# EAGLE design nanomodem (EAGLE 8.5.0)
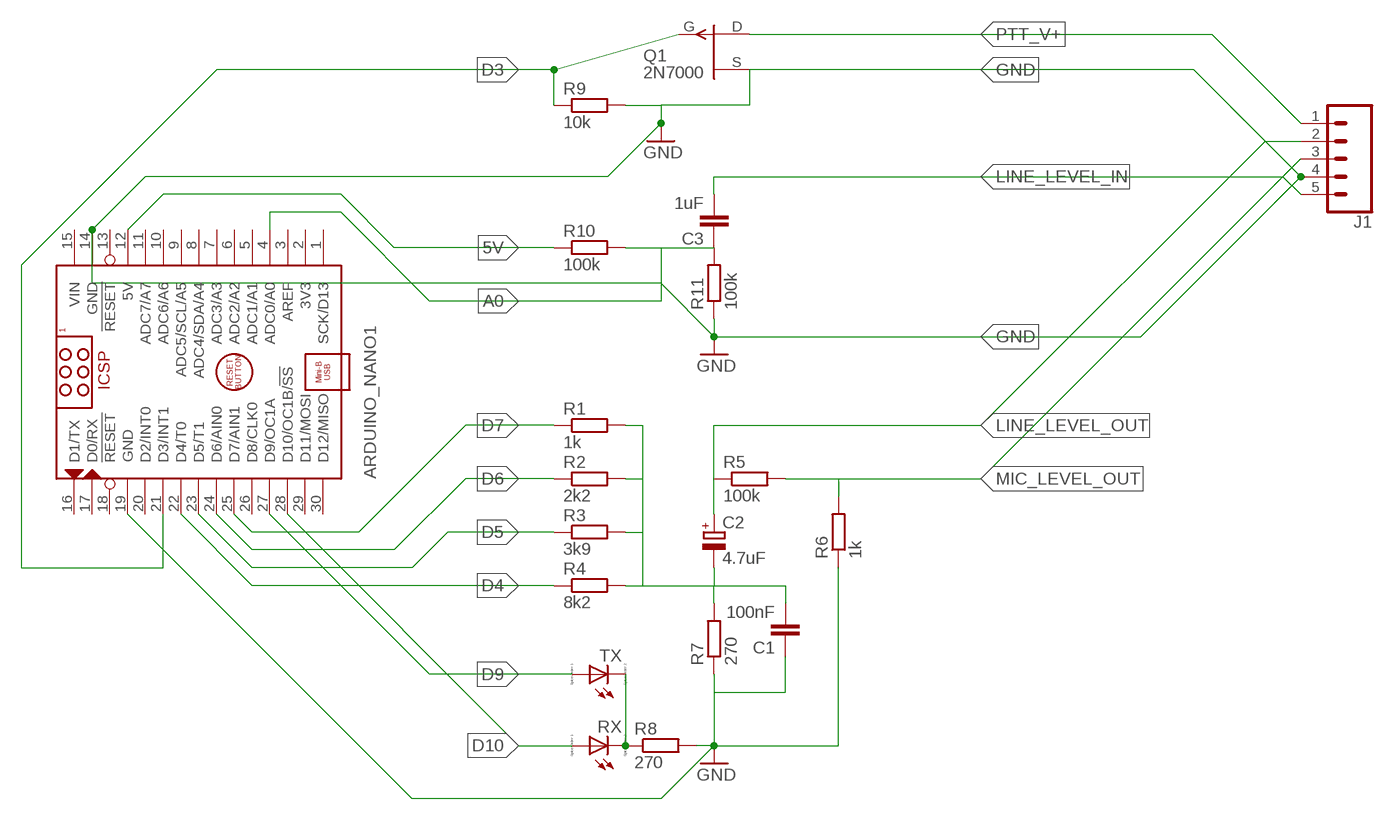
[diagram p0: schematic, sheet 1]

## Parts
ARDUINO_NANO1  ARDUINO_NANO  [ARDUINO_NANO]
C1  100nF  C2.5/2  [C2.5-2]
C2  4.7uF  CPOL-EUE2.5-5V  [E2,5-4R]
C3  1uF  C2.5/2  [C2.5-2]
J1  CONN_05  [1X05]
Q1  2N7000  2N3820  [TO92_MOD]
R1  1k  R-EU_0204/2V  [0204V]
R2  2k2  R-EU_0204/2V  [0204V]
R3  3k9  R-EU_0204/2V  [0204V]
R4  8k2  R-EU_0204/2V  [0204V]
R5  100k  R-EU_0204/2V  [0204V]
R6  1k  R-EU_0204/2V  [0204V]
R7  270  R-EU_0204/2V  [0204V]
R8  270  R-EU_0204/2V  [0204V]
R9  10k  R-EU_0204/2V  [0204V]
R10  100k  R-EU_0204/2V  [0204V]
R11  100k  R-EU_0204/2V  [0204V]
RX  LED_ELD260  [LED_LD260]
TX  LED_ELD260  [LED_LD260]

## Nets
5V: ARDUINO_NANO1.12(5V) R10.1
A0: ARDUINO_NANO1.4(ADC0/A0) C3.1 R10.2 R11.2
D3: ARDUINO_NANO1.21(D3/INT1) Q1.2(G) R9.1
D4: ARDUINO_NANO1.22(D4/T0) R4.1
D5: ARDUINO_NANO1.23(D5/T1) R3.1
D6: ARDUINO_NANO1.24(D6/AIN0) R2.1
D7: ARDUINO_NANO1.25(D7/AIN1) R1.1
D9: ARDUINO_NANO1.27(D9/OC1A) TX.A
D10: ARDUINO_NANO1.28(D10/OC1B/!SS) RX.A
GND: ARDUINO_NANO1.14(GND) ARDUINO_NANO1.19(GND) C1.1 J1.4 Q1.3(D) R6.1 R7.1 R8.2 R9.2 R11.1
LINE_LEVEL_IN: C3.2 J1.5
LINE_LEVEL_OUT: C2.+ J1.2 R5.1
MIC_LEVEL_OUT: J1.3 R5.2 R6.2
N$1: R8.1 RX.K(C) TX.K(C)
N$5: C1.2 C2.- R1.2 R2.2 R3.2 R4.2 R7.2
PTT_V+: J1.1 Q1.1(S)
Unconnected: ARDUINO_NANO1.1(SCK/D13) ARDUINO_NANO1.2(3V3) ARDUINO_NANO1.3(AREF) ARDUINO_NANO1.5(ADC1/A1) ARDUINO_NANO1.6(ADC2/A2) ARDUINO_NANO1.7(ADC3/A3) ARDUINO_NANO1.8(ADC4/SDA/A4) ARDUINO_NANO1.9(ADC5/SCL/A5) ARDUINO_NANO1.10(ADC6/A6) ARDUINO_NANO1.11(ADC7/A7) ARDUINO_NANO1.13(!RESET) ARDUINO_NANO1.16(D1/TX) ARDUINO_NANO1.17(D0/RX) ARDUINO_NANO1.18(!RESET) ARDUINO_NANO1.20(D2/INT0) ARDUINO_NANO1.26(D8/CLK0) ARDUINO_NANO1.29(D11/MOSI) ARDUINO_NANO1.30(D12/MISO)

## Power pins joined to a net without a drawn wire
VIN: ARDUINO_NANO1.15(VIN)

## Library data of the parts
ARDUINO_NANO1 = ArduinoNanoV30:ARDUINO_NANO: Arduino Nano V3.0 Module Overview: The Arduino Nano is a small, complete, and breadboard-friendly board based on the ATmega328 (Arduino Nano 3.x) or ATmega168 (Arduino Nano 2.x). It has more or less the same functionality of the Arduino Duemilanove, but in a different package. It lacks only a DC power jack, and works with a Mini-B USB cable instead of a standard one. The Nano was designed and is being produced by Gravitech <http://www.gravitech.us/arna30wiatp.html>. General specifications: Item Value Microcontroller Atmel ATmega168 or ATmega328 Operating Voltage (logic level) 5 V Input Voltage (recommended) 7-12 V Input Voltage (limits) 6-20 V Digital I/O Pins 14 (of which 6 provide PWM output) Analog Input Pins 8 DC Current per I/O Pin 40 mA Flash Memory 16 KB (ATmega168) or 32 KB (ATmega328) of which 2 KB used by bootloader SRAM 1 KB (ATmega168) or 2 KB (ATmega328) EEPROM 512 bytes (ATmega168) or 1 KB (ATmega328) Clock Speed 16 MHz Dimensions (Inches) 0.73" x 1.70" Dimensions (mm) 18mm x 45mm Overall height About 9 mm (not including pins) Weigth 5 g Power: The Arduino Nano can be powered via the Mini-B USB connection, 6-20V unregulated external power supply (pin 30), or 5V regulated external power supply (pin 27). The power source is automatically selected to the highest voltage source. Memory: The ATmega168 has 16 KB of flash memory for storing code (of which 2 KB is used for the bootloader); the ATmega328 has 32 KB, (also with 2 KB used for the bootloader). The ATmega168 has 1 KB of SRAM and 512 bytes of EEPROM (which can be read and written with the EEPROM library); the ATmega328 has 2 KB of SRAM and 1 KB of EEPROM. Input and Output: Each of the 14 digital pins on the Nano can be used as an input or output, using pinMode(), digitalWrite(), and digitalRead() functions. They operate at 5 volts. Each pin can provide or receive a maximum of 40 mA and has an internal pull-up resistor (disconnected by default) of 20-50 kOhms. In addition, some pins have specialized functions. Visit Arduino - ArduinoBoardNano <https://www.arduino.cc/en/Main/ArduinoBoardNano>
C1 C3 = capacitor-wima:C: CAPACITOR naming: grid - package width
C2 = resistor:CPOL-EU: POLARIZED CAPACITOR, European symbol
J1 = SparkFun-Connectors:CONN_05: Multi connection point. Often used as Generic Header-pin footprint for 0.1 inch spaced/style header connections On any of the 0.1 inch spaced packages, you can populate with these: Break Away Headers - Straight <https://www.sparkfun.com/products/116> (PRT-00116) Break Away Male Headers - Right Angle <https://www.sparkfun.com/products/553> (PRT-00553) Female Headers <https://www.sparkfun.com/products/115> (PRT-00115) Break Away Headers - Machine Pin <https://www.sparkfun.com/products/117> (PRT-00117) Break Away Female Headers - Swiss Machine Pin <https://www.sparkfun.com/products/743> (PRT-00743) For SCREWTERMINALS and SPRING TERMINALS visit here: Screw Terimnals on SparkFun.com <https://www.sparkfun.com/search/results?term=Screw+Terminals> (5mm/3.5mm/2.54mm spacing) This device is also useful as a general connection point to wire up your design to another part of your project. Our various solder wires solder well into these plated through hole pads. Hook-Up Wire - Assortment (Stranded, 22 AWG) <https://www.sparkfun.com/products/11375> (PRT-11375) Hook-Up Wire - Assortment (Solid Core, 22 AWG) <https://www.sparkfun.com/products/11367> (PRT-11367) View the entire wire category on our website here <https://www.sparkfun.com/categories/141> Special notes: Molex polarized connector foot print use with SKU : PRT-08231 with associated crimp pins and housings. 1MM SMD Version SKU: PRT-10208
Q1 = transistor-fet-edited:2N3820: P-Channel Junction FET Source: http://www.fairchildsemi.com/ds/2N/2N3820.pdf
R1-R8 = resistor:R-EU_: RESISTOR, European symbol
R9-R11 = rcl:R-EU_: RESISTOR, European symbol
RX TX = eagle-ltspice:LED_E: LED Source: http://www.osram.convergy.de Source: www.luxeon.com Source: www.kingbright.com; SPICEMODEL: NONE; SPICEPREFIX: D; SPICETYPE: diode

## Board
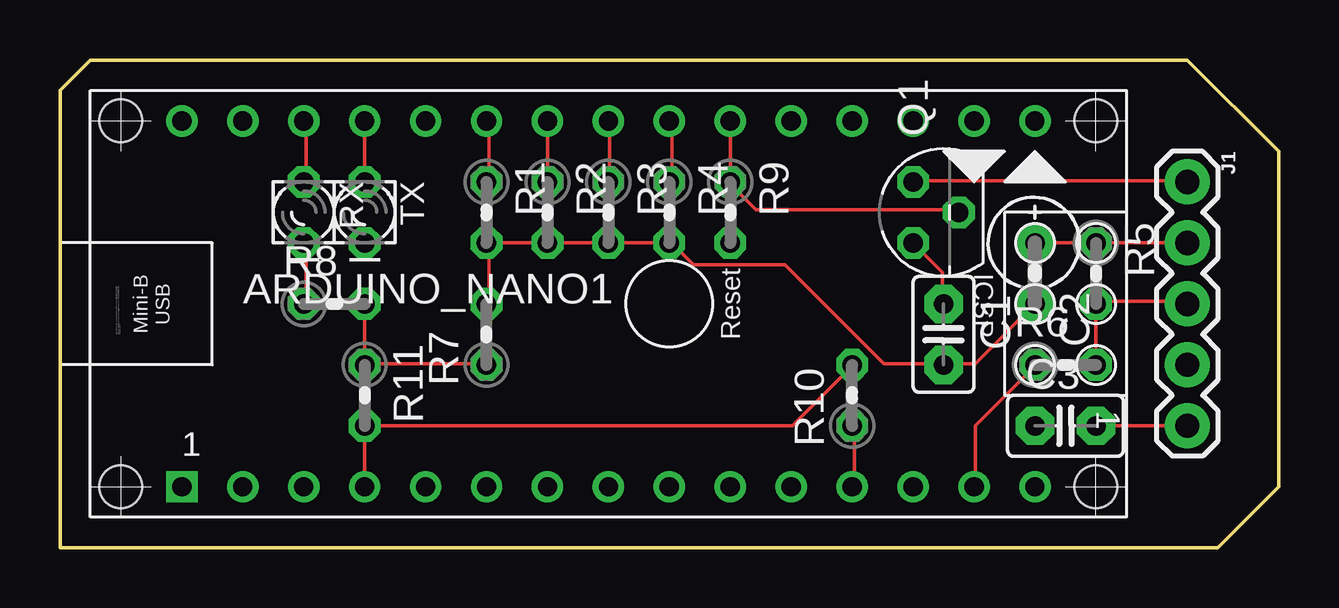
[diagram p1: board, top side]
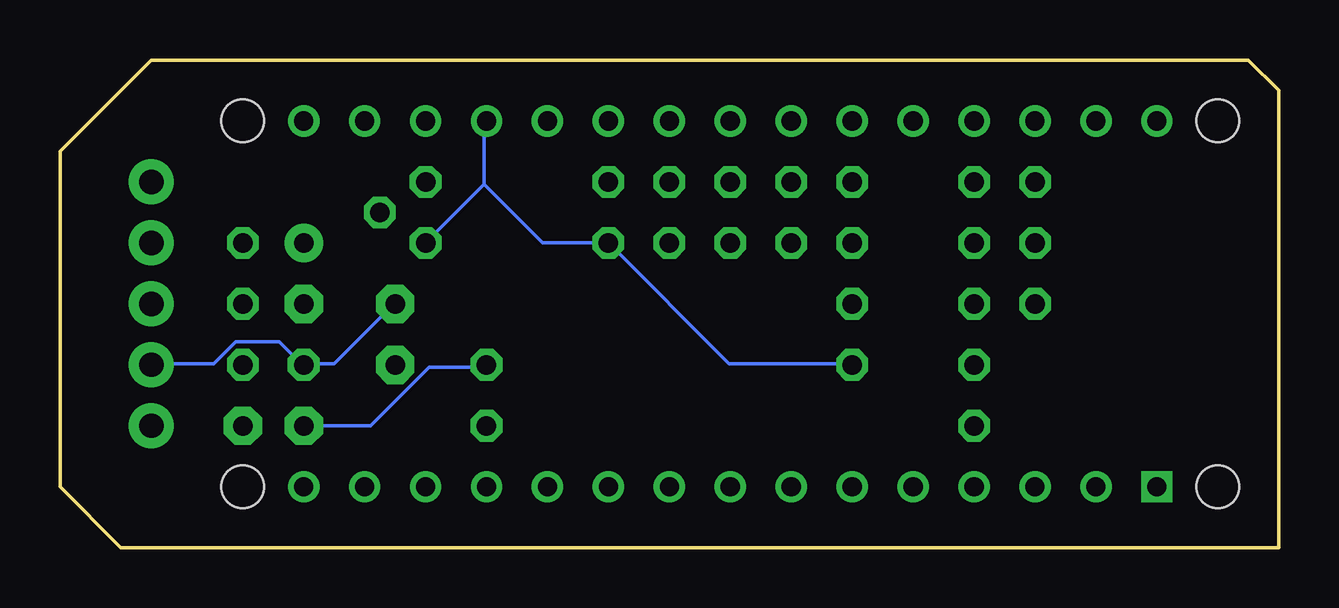
[diagram p2: board, bottom side, seen from below]

Size 50.8 x 20.32 mm. Coordinates in mm from the lower left corner, seen from the top.
Outline: 0,0 0,19.05 1.27,20.32 46.99,20.32 50.8,16.51 50.8,2.54 48.26,0 0,0
Copper layers (1*16): Top 0.035mm / dielectric 1.5mm / Bottom 0.035mm
Design rules "default": minimum track width 6mil, minimum drill 0.35mm, track to track 6mil, track to pad 6mil, pad to pad 6mil, via to via 6mil, smd to smd 6mil, copper to edge 40mil, drill to drill 6mil, minimum pad ring 10mil, minimum via ring 8mil, stop-mask expansion 4mil, vias tented up to drill 0mil, thermal gap 10mil

### Footprints (pad centres in the part's own frame; a part is rotated, then mirrored left to right if it is on the bottom)
ARDUINO_NANO = drill 0.8 square: 1 -20.32,-7.62 | drill 0.8: 2 -17.78,-7.62; 3 -15.24,-7.62; 4 -12.7,-7.62; 5 -10.16,-7.62; 6 -7.62,-7.62; 7 -5.08,-7.62; 8 -2.54,-7.62; 9 0,-7.62; 10 2.54,-7.62; 11 5.08,-7.62; 12 7.62,-7.62; 13 10.16,-7.62; 14 12.7,-7.62; 15 15.24,-7.62; 16 15.24,7.62; 17 12.7,7.62; 18 10.16,7.62; 19 7.62,7.62; 20 5.08,7.62; 21 2.54,7.62; 22 0,7.62; 23 -2.54,7.62; 24 -5.08,7.62; 25 -7.62,7.62; 26 -10.16,7.62; 27 -12.7,7.62; 28 -15.24,7.62; 29 -17.78,7.62; 30 -20.32,7.62 | hole 1.778: -22.86,-7.62; -22.86,7.62; 17.78,7.62; 17.78,-7.62
C2.5-2 = drill 0.813 pad 1.6 octagon: 1 -1.27,0; 2 1.27,0
E2,5-4R = drill 0.813 pad 1.6: + -1.27,0 | drill 0.813 pad 1.6 octagon: - 1.27,0
1X05 = drill 1.016 pad 1.88: 1 0,0; 2 2.54,0; 3 5.08,0; 4 7.62,0; 5 10.16,0
TO92_MOD = drill 0.813 octagon: 1 1.27,1.27; 2 0,-0.635; 3 -1.27,1.27
0204V = drill 0.813 octagon: 1 -1.27,0; 2 1.27,0
LED_LD260 = drill 0.813 octagon: A -1.27,0; K 1.27,0

### Placement (x,y rotation side)
ARDUINO_NANO1  25.4,10.16 0 top
C1  36.83,8.89 270 top
C2  40.64,11.43 270 top
C3  41.91,5.08 0 top
J1  46.99,15.24 270 top
Q1  36.83,13.97 90 top
R1  17.78,13.97 270 top
R2  20.32,13.97 270 top
R3  22.86,13.97 270 top
R4  25.4,13.97 270 top
R5  43.18,11.43 270 top
R6  41.91,7.62 0 top
R7  17.78,8.89 90 top
R8  11.43,10.16 0 top
R9  27.94,13.97 270 top
R10  33.02,6.35 90 top
R11  12.7,6.35 270 top
RX  10.16,13.97 270 top
TX  12.7,13.97 270 top

### Tracks (layer width: path | path; a pad name or v marks a point on that pad's centre or on a via)
5V
  Top 0.152: ARDUINO_NANO1.12 33.12,2.64 33.12,5.08 R10.1
A0
  Top 0.152: ARDUINO_NANO1.4 R11.2 30.53,5.08 32.97,7.52 R10.2
  Bottom 0.152: C3.1 37.85,5.08 35.41,7.52 33.12,7.52 R10.2
D3
  Top 0.152: ARDUINO_NANO1.21 R9.1 27.94,15.14 29.01,14.07 37.39,14.07 Q1.2
D4
  Top 0.152: ARDUINO_NANO1.22 25.5,17.73 25.5,15.29 R4.1
D5
  Top 0.152: ARDUINO_NANO1.23 22.91,17.73 22.91,15.29 R3.1
D6
  Top 0.152: R2.1 ARDUINO_NANO1.24
D7
  Top 0.152: ARDUINO_NANO1.25 17.88,17.73 17.88,15.29 R1.1
D9
  Top 0.152: TX.A ARDUINO_NANO1.27
D10
  Top 0.152: ARDUINO_NANO1.28 10.26,17.73 10.26,15.29 RX.A
GND
  Top 0.152: ARDUINO_NANO1.14 38.15,2.64 38.15,5.08 40.59,7.52 R6.1 | R8.2 12.7,7.67 | 12.7,7.67 17.73,7.67 R7.1 | 12.7,7.67 R11.1 | Q1.3 36.78,11.48 36.78,10.26 C1.1
  Bottom 0.152: J1.4 46.99,7.67 44.4,7.67 43.49,8.59 41.66,8.59 40.74,7.67 R6.1 40.59,7.67 39.37,7.67 36.93,10.11 C1.1 | 33.12,15.14 33.12,17.73 ARDUINO_NANO1.19 | Q1.3 33.12,15.14 | 33.12,15.14 30.68,12.7 R9.2 22.91,7.67 17.88,7.67 R7.1
LINE_LEVEL_IN
  Top 0.152: J1.5 C3.2
LINE_LEVEL_OUT
  Top 0.152: C2.+ R5.1 J1.2
MIC_LEVEL_OUT
  Top 0.152: R6.2 R5.2 43.18,10.26 46.99,10.26 J1.3
N$1
  Top 0.152: 10.26,12.7 10.26,10.26 R8.1 | 10.26,12.7 TX.K | 10.26,12.7 RX.K
N$5
  Top 0.152: C2.- 38.15,7.67 36.93,7.67 C1.2 36.78,7.67 34.34,7.67 30.23,11.79 26.42,11.79 25.5,12.7 R4.2 R3.2 R2.2 17.88,12.7 | 17.88,12.7 17.88,10.26 R7.2 | 17.88,12.7 R1.2
PTT_V+
  Top 0.152: Q1.1 35.56,15.29 46.99,15.29 J1.1